# Altium schematic sheet Sheet1.SchDoc
size A3
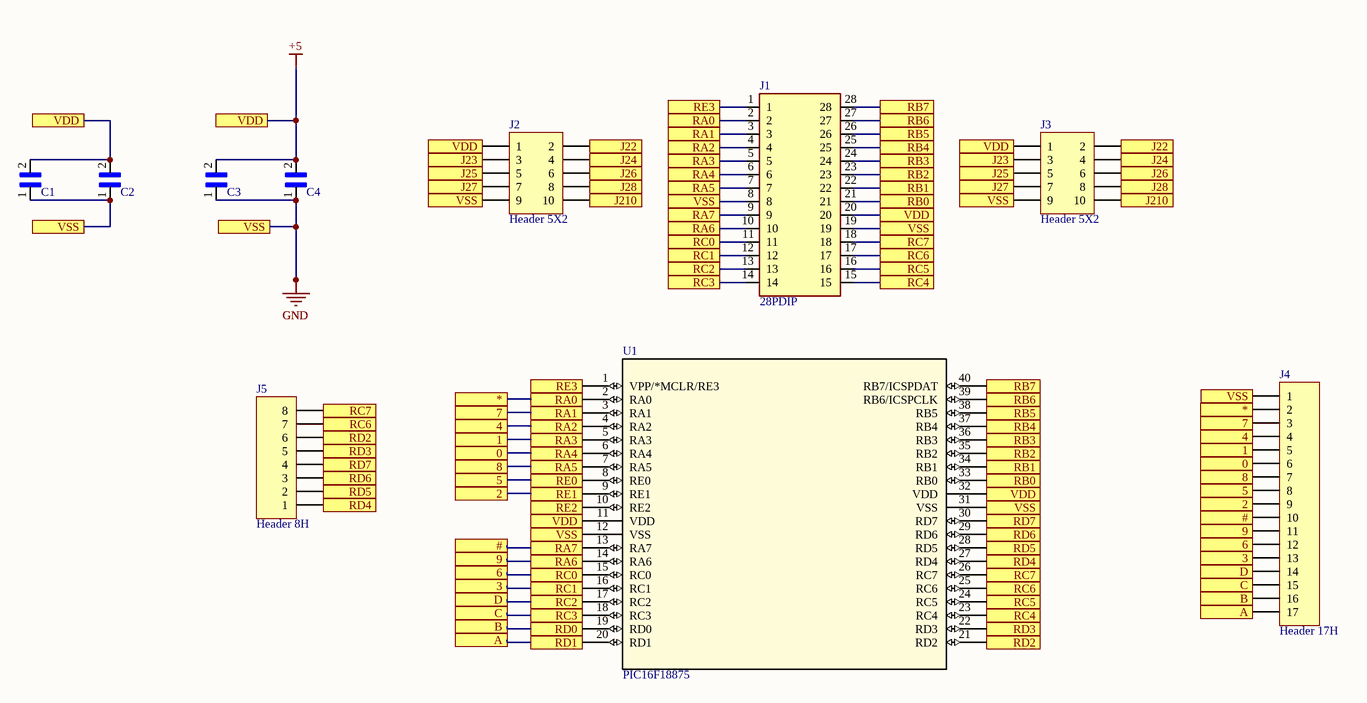
[diagram p0: Sheet1.SchDoc]

## Parts
C1  MLCC - SMD 1206  [MLCC SMD 1206]  (value not drawn)
C2  MLCC - SMD 1206  [MLCC SMD 1206]  (value not drawn)
C3  MLCC - SMD 1206  [MLCC SMD 1206]  (value not drawn)
C4  MLCC - SMD 1206  [MLCC SMD 1206]  (value not drawn)
J1  28PDIP  [28 PIN DIP]
J2  Header 5X2  [HDR2X5]
J3  Header 5X2  [HDR2X5]
J4  Header 17H  [HDR1X17H]
J5  Header 8H  [HDR1X8H]
U1  PIC16F18875  [PIC16F18875]

## Ports
0, 1, 2, 3, 4, 5, 6, 7, 8, 9, #, *, A, B, C, D, J22, J23, J24, J25, J26, J27, J28, J210, RA0, RA1, RA2, RA3, RA4, RA5, RA6, RA7, RB0, RB1, RB2, RB3, RB4, RB5, RB6, RB7, RC0, RC1, RC2, RC3, RC4, RC5, RC6, RC7, RD0, RD1, RD2, RD3, RD4, RD5, RD6, RD7, RE0, RE1, RE2, RE3, VDD, VSS

## Nets
+5: C1.2 C2.2 C3.2 C4.2 J1.20 J2.1 J3.1 U1.11(VDD) U1.32(VDD) ; port VDD
GND: C1.1 C2.1 C3.1 C4.1 J1.8 J1.19 J2.9 J3.9 J4.1 U1.12(VSS) U1.31(VSS) ; port VSS
0: J1.6 J4.6 U1.6(RA4) ; port RA4, port 0
1: J1.5 J4.5 U1.5(RA3) ; port RA3, port 1
2: J4.9 U1.9(RE1) ; port RE1, port 2
3: J1.12 J4.13 U1.16(RC1) ; port RC1, port 3
4: J1.4 J4.4 U1.4(RA2) ; port RA2, port 4
5: J4.8 U1.8(RE0) ; port RE0, port 5
6: J1.11 J4.12 U1.15(RC0) ; port RC0, port 6
7: J1.3 J4.3 U1.3(RA1) ; port RA1, port 7
8: J1.7 J4.7 U1.7(RA5) ; port RA5, port 8
9: J1.10 J4.11 U1.14(RA6) ; port RA6, port 9
#: J1.9 J4.10 U1.13(RA7) ; port RA7, port #
*: J1.2 J4.2 U1.2(RA0) ; port RA0, port *
A: J4.17 U1.20(RD1) ; port RD1, port A
B: J4.16 U1.19(RD0) ; port RD0, port B
C: J1.14 J4.15 U1.18(RC3) ; port RC3, port C
D: J1.13 J4.14 U1.17(RC2) ; port RC2, port D
J22: J2.2 J3.2 ; port J22
J23: J2.3 J3.3 ; port J23
J24: J2.4 J3.4 ; port J24
J25: J2.5 J3.5 ; port J25
J26: J2.6 J3.6 ; port J26
J27: J2.7 J3.7 ; port J27
J28: J2.8 J3.8 ; port J28
J210: J2.10 J3.10 ; port J210
RB0: J1.21 U1.33(RB0) ; port RB0
RB1: J1.22 U1.34(RB1) ; port RB1
RB2: J1.23 U1.35(RB2) ; port RB2
RB3: J1.24 U1.36(RB3) ; port RB3
RB4: J1.25 U1.37(RB4) ; port RB4
RB5: J1.26 U1.38(RB5) ; port RB5
RB6: J1.27 U1.39(RB6/ICSPCLK) ; port RB6
RB7: J1.28 U1.40(RB7/ICSPDAT) ; port RB7
RC4: J1.15 U1.23(RC4) ; port RC4
RC5: J1.16 U1.24(RC5) ; port RC5
RC6: J1.17 J5.7 U1.25(RC6) ; port RC6
RC7: J1.18 J5.8 U1.26(RC7) ; port RC7
RD2: J5.6 U1.21(RD2) ; port RD2
RD3: J5.5 U1.22(RD3) ; port RD3
RD4: J5.1 U1.27(RD4) ; port RD4
RD5: J5.2 U1.28(RD5) ; port RD5
RD6: J5.3 U1.29(RD6) ; port RD6
RD7: J5.4 U1.30(RD7) ; port RD7
RE2: U1.10(RE2) ; port RE2
RE3: J1.1 U1.1(VPP/*MCLR/RE3) ; port RE3

## Library data of the parts
C1-C4 = MLCC - SMD 1206: 50V
J1 = 28 pin dip
J2 J3 = Header 5X2: Header, 5-Pin, Dual row; LatestRevisionDate: 17-Jul-2002; LatestRevisionNote: Re-released for DXP Platform.; Publisher: Altium Limited
J4 = Header 17H: Header, 17-Pin, Right Angle; LatestRevisionDate: 17-Jul-2002; LatestRevisionNote: Re-released for DXP Platform.; Publisher: Altium Limited
J5 = Header 8H: Header, 8-Pin, Right Angle; LatestRevisionDate: 17-Jul-2002; LatestRevisionNote: Re-released for DXP Platform.; Publisher: Altium Limited; ComponentLink1Description: teclado; ComponentLink1URL: https://docs.rs-online.com/5497/0900766b80bf4f45.pdf
U1 = PIC16F18875: 40-pin PDIP; ComponentLink1Description: Datasheet; ComponentLink1URL: https://ww1.microchip.com/downloads/en/DeviceDoc/PIC16(L)F18855-75-Data-Sheet-40001802H.pdf; ComponentLink2Description: Development Kit; ComponentLink2URL: https://docs.rs-online.com/cec5/0900766b8152ff63.pdf